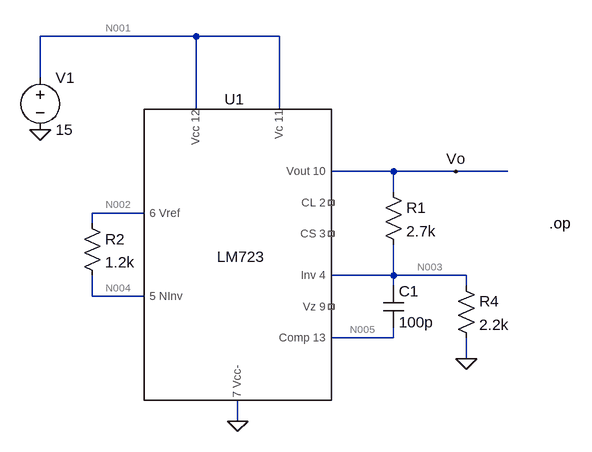
[diagram p0: schematic high voltage regulator .asc]
high voltage regulator .asc, the LTspice schematic file:
Version 4
SHEET 1 880 680
WIRE 80 -208 -160 -208
WIRE 208 -208 80 -208
WIRE -160 -144 -160 -208
WIRE 80 -96 80 -208
WIRE 208 -96 208 -208
WIRE 384 0 288 0
WIRE 480 0 384 0
WIRE 560 0 480 0
WIRE 384 32 384 0
WIRE 0 64 -80 64
WIRE -80 80 -80 64
WIRE 384 160 384 112
WIRE 384 160 288 160
WIRE 496 160 384 160
WIRE 384 176 384 160
WIRE 496 176 496 160
WIRE -80 192 -80 160
WIRE 0 192 -80 192
WIRE 384 256 384 240
WIRE 384 256 288 256
WIRE 496 288 496 256
WIRE 144 384 144 352
FLAG -160 -64 0
FLAG 480 0 Vo
FLAG 496 288 0
FLAG 144 384 0
SYMBOL LM723 144 32 R0
SYMATTR InstName U1
SYMBOL res 368 16 R0
SYMATTR InstName R1
SYMATTR Value 2.7k
SYMBOL cap 368 176 R0
SYMATTR InstName C1
SYMATTR Value 100p
SYMBOL res -96 64 R0
SYMATTR InstName R2
SYMATTR Value 1.2k
SYMBOL voltage -160 -160 R0
WINDOW 123 0 0 Left 0
WINDOW 39 0 0 Left 0
SYMATTR InstName V1
SYMATTR Value 15
SYMBOL res 480 160 R0
SYMATTR InstName R4
SYMATTR Value 2.2k
TEXT 624 80 Left 2 !.op

The netlist it stands for:
* high voltage regulator .asc
XU1 NC_01 NC_02 N003 N004 N002 0 NC_03 Vo N001 N001 N005 LM723  ; pins CL_2 CS_3 Inv_4 5_NInv 6_Vref 7_Vcc- Vz_9 Vout_10 Vc_11 Vcc_12 Comp_13
R1 Vo N003 2.7k
C1 N003 N005 100p
R2 N002 N004 1.2k
V1 N001 0 15
R4 N003 0 2.2k
.op
.lib lm723.sub
.backanno
.end

* Results of the author's LTspice run, read from the files saved beside the schematic
* Operating Point:
*   V(n001) = 15 V
*   V(n005) = 15.64 V
*   V(n004) = 7.125 V
*   V(n003) = 6.427 V
*   V(n002) = 7.15 V
*   V(vo) = 14.31 V
*   I(C1) = 0 A
*   I(R4) = 2.921 mA
*   I(R2) = 20.82 µA
*   I(R1) = 2.921 mA
*   I(V1) = -4.116 mA
*   Ix(u1:2) = 0 A
*   Ix(u1:3) = 0 A
*   Ix(u1:4) = -9.263 pA
*   Ix(u1:5) = 20.82 µA
*   Ix(u1:6) = -20.82 µA
*   Ix(u1:7) = -1.195 mA
*   Ix(u1:9) = 0 A
*   Ix(u1:10) = -2.921 mA
*   Ix(u1:11) = 2.824 mA
*   Ix(u1:12) = 1.292 mA
*   Ix(u1:13) = 0 A
* From the log:
*   Semiconductor Device Operating Points:
*                           --- Diodes ---
*   Name:    d:u1:z
*   Model:    u1:dz
*   Id:        NaN
*   Vd:      -5.54e+0
*   Req:      8.02e+9
*   CAP:      0.00e+0
*                           --- Bipolar Transistors ---
*   Name:     q:u1:3      q:u1:2      q:u1:1      q:u1:4      q:u1:5
*   Model:    u1:npn1     u1:npn1     u1:npn1     u1:npn1     u1:npn1
*   Ib:         NaN        5.14e-5     5.83e-4      NaN        2.08e-5
*   Ic:         NaN        2.82e-3    -4.86e-4      NaN        1.15e-3
*   Vbe:       1.70e-1     6.82e-1     6.44e-1    -3.92e-2     6.59e-1
*   Vbc:      -7.97e+0    -3.59e-3     6.41e-1    -9.21e+0    -7.88e+0
*   Vce:       8.14e+0     6.86e-1     3.59e-3     9.17e+0     8.53e+0
*   BetaDC:   -1.98e+0     5.50e+1    -8.34e-1    -9.96e-1     5.50e+1
*   Gm:         NaN        1.09e-1     3.28e-3      NaN        4.43e-2
*   Rpi:        NaN        5.04e+2     2.17e+3      NaN        1.24e+3
*   Rx:        0.00e+0     0.00e+0     0.00e+0     0.00e+0     0.00e+0
*   Ro:        0.00e+0      NaN        4.53e+1     0.00e+0     0.00e+0
*   Cbe:       0.00e+0     0.00e+0     0.00e+0     0.00e+0     0.00e+0
*   Cbc:       0.00e+0     0.00e+0     0.00e+0     0.00e+0     0.00e+0
*   Cjs:       0.00e+0     0.00e+0     0.00e+0     0.00e+0     0.00e+0
*   BetaAC:    4.59e+1     5.50e+1     7.12e+0     8.49e-2     5.50e+1
*   Cbx:       0.00e+0     0.00e+0     0.00e+0     0.00e+0     0.00e+0
*   Ft:        0.00e+0     0.00e+0     0.00e+0     0.00e+0     0.00e+0